# Altium project FMA_Force_Sensor_board.PrjPcb
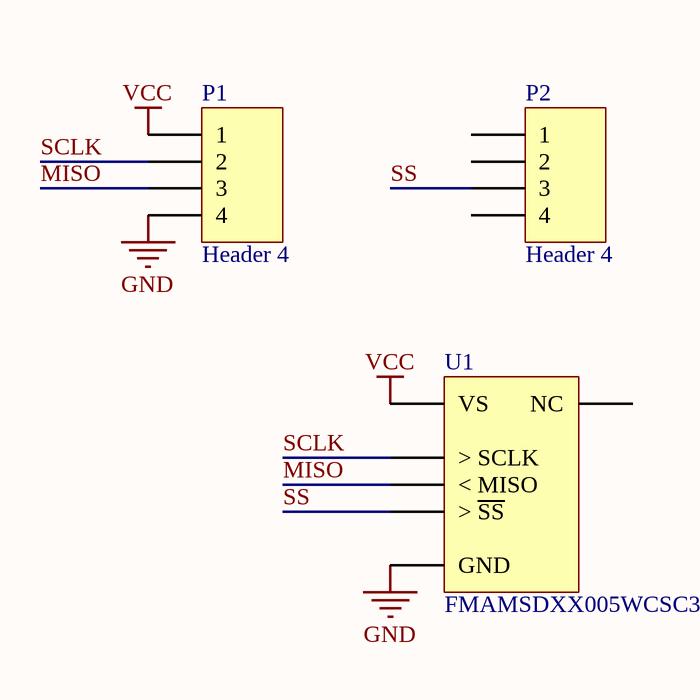
[diagram p0: Sample_v1.SchDoc]
5 sheets, 18 parts. Net scope: global (net labels, ports and power ports of the same name join across sheets).
Board files: Sample_v1.PcbDoc, SampleCompact2.PcbDoc, Sample_FPC_v1_new.PcbDoc, Sample_FPC_v1.PcbDoc, Sample_FFC_Con_Sensor_v1.PcbDoc, Sample_FPC_FFC_TestBoard_Flipped_v1.PcbDoc
Sheets:
  Sample_v1.SchDoc
  SampleCompact.SchDoc
  Sample_FPC_v1.SchDoc
  Sample_FFC_Con_Sensor_v1.SchDoc
  Sample_FPC_FFC_TestBoard.SchDoc

## Sheet Sample_v1.SchDoc
size A4; SheetNumber: 1; SheetTotal: 5

### Parts
P1  Header 4  [HDR1X4]
P2  Header 4  [HDR1X4]
U1  FMAMSDXX005WCSC3  [FMA_MICROFORCE_6]

### Nets
GND: P1.4 U1.3(GND)
VCC: P1.1 U1.1(VS)
MISO: P1.3 U1.5(<_MISO)
SCLK: P1.2 U1.4(>_SCLK)
SS: P2.3 U1.2(>_~{SS})

Not connected (* = marked no-connect by the designer): P2 1 2 4; U1 6(NC)

### Library data of the parts
P1 P2 = Header 4: Header, 4-Pin; LatestRevisionDate: 17-Jul-2002; LatestRevisionNote: Re-released for DXP Platform.; Publisher: Altium Limited
U1 = FMAMSDXX005WCSC3: Force Range: 5N / Output: SPI / FMA Series Force Sensor, compensated/amplified, mechanically / coupled, sphere contact element, sensor short and open / diagnostics, 5 N force range, compression force type, SPI digital / output, 20% to 80% transfer function, 3.3 V ±10% supply voltage

## Sheet SampleCompact.SchDoc
size A4; SheetNumber: 2; SheetTotal: 5
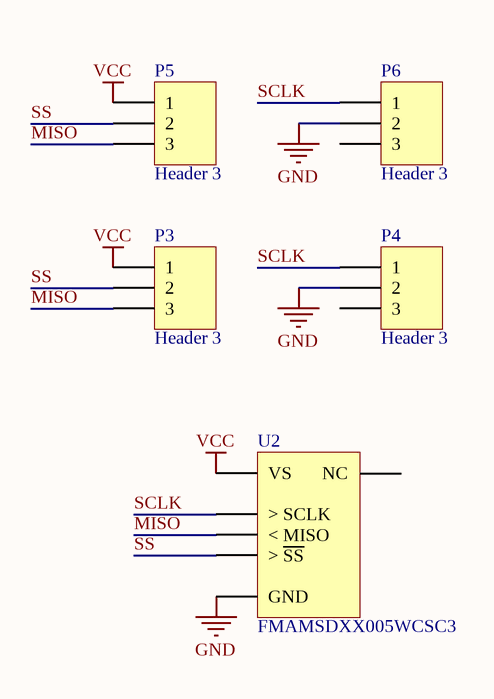
[diagram p1: SampleCompact.SchDoc]

### Parts
P3  Header 3  [HDR1X3]
P4  Header 3  [HDR1X3]
P5  Header 3  [HDR1X3]
P6  Header 3  [HDR1X3]
U2  FMAMSDXX005WCSC3  [FMA_MICROFORCE_6]

### Nets
GND: P4.2 P6.2 U2.3(GND)
VCC: P3.1 P5.1 U2.1(VS)
MISO: P3.3 P5.3 U2.5(<_MISO)
SCLK: P4.1 P6.1 U2.4(>_SCLK)
SS: P3.2 P5.2 U2.2(>_~{SS})

Not connected (* = marked no-connect by the designer): P4 3; P6 3; U2 6(NC)

### Library data of the parts
P3-P6 = Header 3: Header, 3-Pin; LatestRevisionDate: 17-Jul-2002; LatestRevisionNote: Re-released for DXP Platform.; Publisher: Altium Limited
U2 = FMAMSDXX005WCSC3: as U1 on sheet Sample_v1

## Sheet Sample_FPC_v1.SchDoc
size A3; SheetNumber: 3; SheetTotal: 5
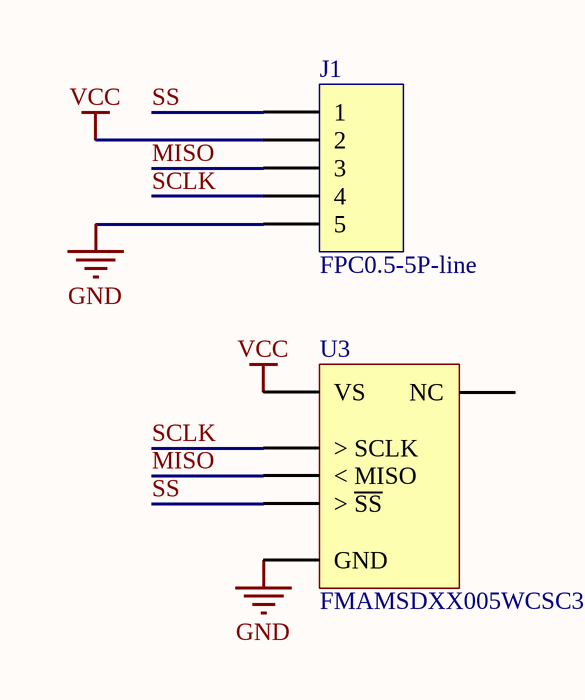
[diagram p2: Sample_FPC_v1.SchDoc]

### Parts
J1  FPC0.5-5P-line  [FPC0.5-5P-Line]
U3  FMAMSDXX005WCSC3  [FMA_MICROFORCE_6]

### Nets
GND: J1.5 U3.3(GND)
VCC: J1.2 U3.1(VS)
MISO: J1.3 U3.5(<_MISO)
SCLK: J1.4 U3.4(>_SCLK)
SS: J1.1 U3.2(>_~{SS})

Not connected (* = marked no-connect by the designer): U3 6(NC)

### Library data of the parts
U3 = FMAMSDXX005WCSC3: as U1 on sheet Sample_v1

## Sheet Sample_FFC_Con_Sensor_v1.SchDoc
size A3; SheetNumber: 4; SheetTotal: 5
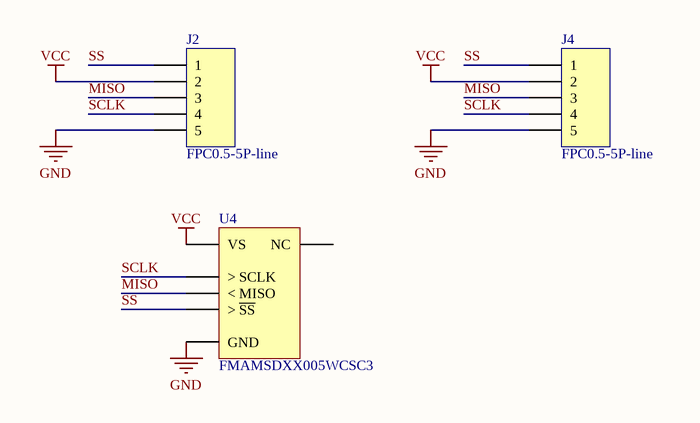
[diagram p3: Sample_FFC_Con_Sensor_v1.SchDoc]

### Parts
J2  FPC0.5-5P-line  [FPC0.5-5P-Line]
J4  FPC0.5-5P-line  [FPC0.5-5P-Line]
U4  FMAMSDXX005WCSC3  [FMA_MICROFORCE_6-EXTENED]

### Nets
GND: J2.5 J4.5 U4.3(GND)
VCC: J2.2 J4.2 U4.1(VS)
MISO: J2.3 J4.3 U4.5(<_MISO)
SCLK: J2.4 J4.4 U4.4(>_SCLK)
SS: J2.1 J4.1 U4.2(>_~{SS})

Not connected (* = marked no-connect by the designer): U4 6(NC)

### Library data of the parts
U4 = FMAMSDXX005WCSC3: as U1 on sheet Sample_v1

## Sheet Sample_FPC_FFC_TestBoard.SchDoc
size A3; SheetNumber: 5; SheetTotal: 5
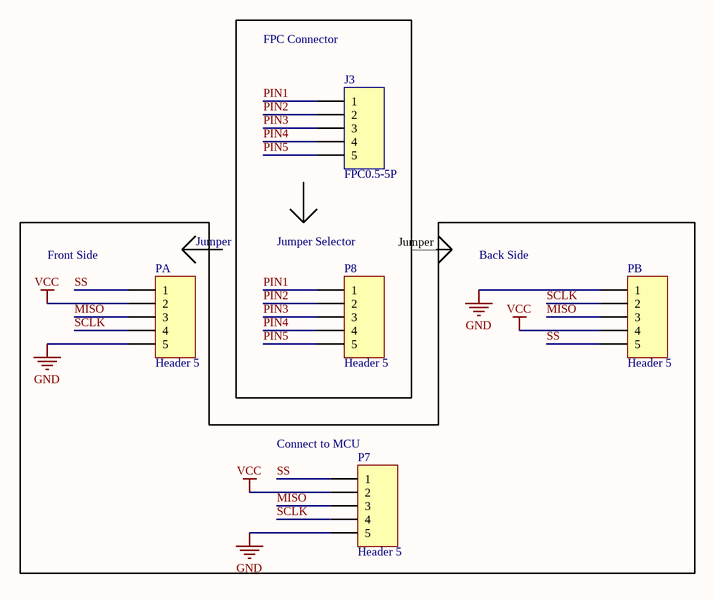
[diagram p4: Sample_FPC_FFC_TestBoard.SchDoc]

### Parts
J3  FPC0.5-5P  [FPC0.5-5P]
P7  Header 5  [HDR1X5]
P8  Header 5  [HDR1X5-2]
PA  Header 5  [HDR1X5-2]
PB  Header 5  [HDR1X5-2]

### Nets
GND: P7.5 PA.5 PB.1
VCC: P7.2 PA.2 PB.4
MISO: P7.3 PA.3 PB.3
PIN1: J3.1 P8.1
PIN2: J3.2 P8.2
PIN3: J3.3 P8.3
PIN4: J3.4 P8.4
PIN5: J3.5 P8.5
SCLK: P7.4 PA.4 PB.2
SS: P7.1 PA.1 PB.5

### Notes on the sheet
- FPC Connector
- Front Side
- Jumper
- (near P8) Jumper Selector
- Back Side
- (near P7) Connect to MCU

### Library data of the parts
P7 P8 PA PB = Header 5: Header, 4-Pin; LatestRevisionDate: 17-Jul-2002; LatestRevisionNote: Re-released for DXP Platform.; Publisher: Altium Limited

## Nets that join several sheets
GND: Sample_v1 (P1.4 U1.3), SampleCompact (P4.2 P6.2 U2.3), Sample_FPC_v1 (J1.5 U3.3), Sample_FFC_Con_Sensor_v1 (J2.5 J4.5 U4.3), Sample_FPC_FFC_TestBoard (P7.5 PA.5 PB.1)
VCC: Sample_v1 (P1.1 U1.1), SampleCompact (P3.1 P5.1 U2.1), Sample_FPC_v1 (J1.2 U3.1), Sample_FFC_Con_Sensor_v1 (J2.2 J4.2 U4.1), Sample_FPC_FFC_TestBoard (P7.2 PA.2 PB.4)
MISO: Sample_v1 (P1.3 U1.5), SampleCompact (P3.3 P5.3 U2.5), Sample_FPC_v1 (J1.3 U3.5), Sample_FFC_Con_Sensor_v1 (J2.3 J4.3 U4.5), Sample_FPC_FFC_TestBoard (P7.3 PA.3 PB.3)
SCLK: Sample_v1 (P1.2 U1.4), SampleCompact (P4.1 P6.1 U2.4), Sample_FPC_v1 (J1.4 U3.4), Sample_FFC_Con_Sensor_v1 (J2.4 J4.4 U4.4), Sample_FPC_FFC_TestBoard (P7.4 PA.4 PB.2)
SS: Sample_v1 (P2.3 U1.2), SampleCompact (P3.2 P5.2 U2.2), Sample_FPC_v1 (J1.1 U3.2), Sample_FFC_Con_Sensor_v1 (J2.1 J4.1 U4.2), Sample_FPC_FFC_TestBoard (P7.1 PA.1 PB.5)